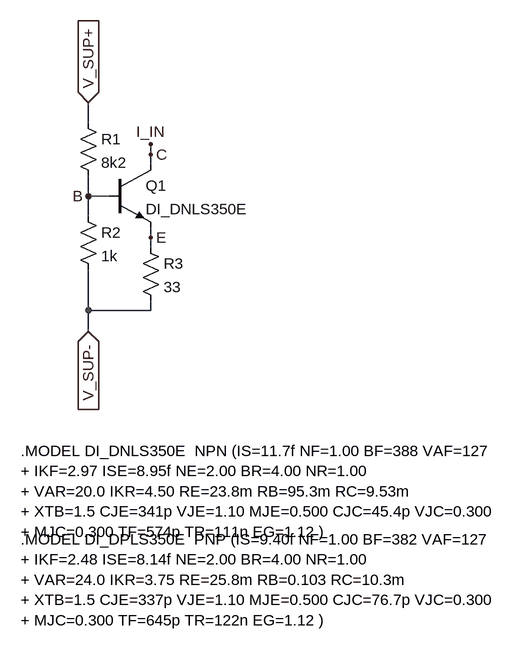
[diagram p0: schematic current_source_lowside.asc]
current_source_lowside.asc, the LTspice schematic file:
Version 4
SHEET 1 912 680
WIRE 240 -320 240 -352
WIRE 336 -272 336 -288
WIRE 336 -256 336 -272
WIRE 240 -208 240 -240
WIRE 272 -208 240 -208
WIRE 240 -176 240 -208
WIRE 336 -144 336 -160
WIRE 336 -128 336 -144
WIRE 240 -32 240 -96
WIRE 336 -32 336 -48
WIRE 336 -32 240 -32
WIRE 240 0 240 -32
FLAG 240 0 V_SUP-
IOPIN 240 0 In
FLAG 240 -352 V_SUP+
IOPIN 240 -352 In
FLAG 336 -288 I_IN
FLAG 240 -208 B
FLAG 336 -144 E
FLAG 336 -272 C
SYMBOL npn 272 -256 R0
SYMATTR InstName Q1
SYMATTR Value DI_DNLS350E
SYMBOL res 224 -336 R0
SYMATTR InstName R1
SYMATTR Value 8k2
SYMBOL res 224 -192 R0
SYMATTR InstName R2
SYMATTR Value 1k
SYMBOL res 320 -144 R0
SYMATTR InstName R3
SYMATTR Value 33
TEXT 136 184 Left 2 !.MODEL DI_DNLS350E  NPN (IS=11.7f NF=1.00 BF=388 VAF=127\n+ IKF=2.97 ISE=8.95f NE=2.00 BR=4.00 NR=1.00\n+ VAR=20.0 IKR=4.50 RE=23.8m RB=95.3m RC=9.53m\n+ XTB=1.5 CJE=341p VJE=1.10 MJE=0.500 CJC=45.4p VJC=0.300\n+ MJC=0.300 TF=574p TR=111n EG=1.12 )
TEXT 136 320 Left 2 !.MODEL DI_DPLS350E  PNP (IS=9.40f NF=1.00 BF=382 VAF=127\n+ IKF=2.48 ISE=8.14f NE=2.00 BR=4.00 NR=1.00\n+ VAR=24.0 IKR=3.75 RE=25.8m RB=0.103 RC=10.3m\n+ XTB=1.5 CJE=337p VJE=1.10 MJE=0.500 CJC=76.7p VJC=0.300\n+ MJC=0.300 TF=645p TR=122n EG=1.12 )

The netlist it stands for:
* current_source_lowside.asc
Q1 C B E 0 DI_DNLS350E
R1 V_SUP+ B 8k2
R2 B V_SUP- 1k
R3 E V_SUP- 33
.model NPN NPN
.model PNP PNP
.lib standard.bjt
.MODEL DI_DNLS350E  NPN (IS=11.7f NF=1.00 BF=388 VAF=127
+ IKF=2.97 ISE=8.95f NE=2.00 BR=4.00 NR=1.00
+ VAR=20.0 IKR=4.50 RE=23.8m RB=95.3m RC=9.53m
+ XTB=1.5 CJE=341p VJE=1.10 MJE=0.500 CJC=45.4p VJC=0.300
+ MJC=0.300 TF=574p TR=111n EG=1.12 )
.MODEL DI_DPLS350E  PNP (IS=9.40f NF=1.00 BF=382 VAF=127
+ IKF=2.48 ISE=8.14f NE=2.00 BR=4.00 NR=1.00
+ VAR=24.0 IKR=3.75 RE=25.8m RB=0.103 RC=10.3m
+ XTB=1.5 CJE=337p VJE=1.10 MJE=0.500 CJC=76.7p VJC=0.300
+ MJC=0.300 TF=645p TR=122n EG=1.12 )
.backanno
.end